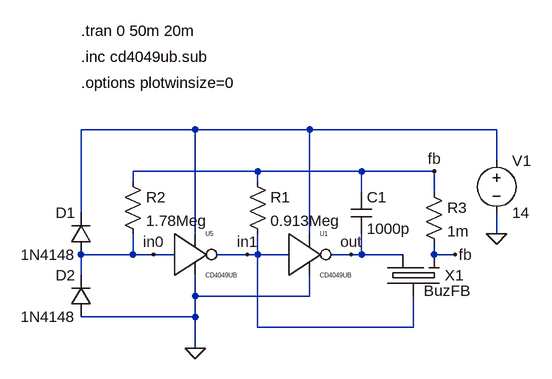
[diagram p0: schematic oscillator test_inverter.asc]
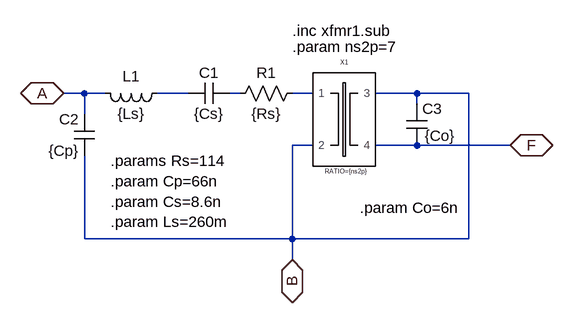
[diagram p1: sub-circuit buzfb.asc]
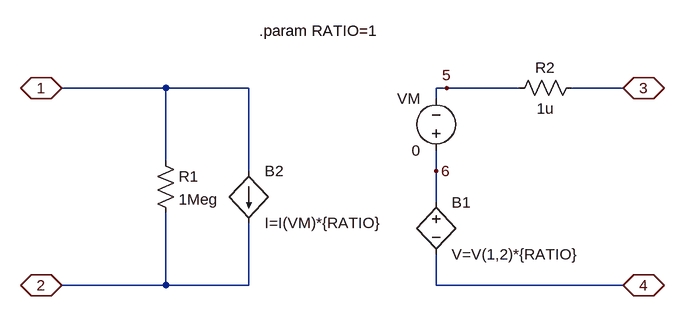
[diagram p2: sub-circuit xmfr1.asc]
oscillator test_inverter.asc, the LTspice schematic file:
Version 4
SHEET 1 1844 964
WIRE 240 -192 64 -192
WIRE 416 -192 240 -192
WIRE 704 -192 416 -192
WIRE 704 -144 704 -192
WIRE 336 -128 144 -128
WIRE 496 -128 336 -128
WIRE 608 -128 496 -128
WIRE 144 -112 144 -128
WIRE 336 -112 336 -128
WIRE 496 -96 496 -128
WIRE 608 -96 608 -128
WIRE 64 -64 64 -192
WIRE 240 -32 240 -192
WIRE 416 -32 416 -192
WIRE 704 -32 704 -64
WIRE 144 0 144 -32
WIRE 144 0 64 0
WIRE 176 0 144 0
WIRE 208 0 176 0
WIRE 320 0 272 0
WIRE 336 0 336 -32
WIRE 336 0 320 0
WIRE 384 0 336 0
WIRE 480 0 448 0
WIRE 496 0 496 -32
WIRE 496 0 480 0
WIRE 560 0 496 0
WIRE 608 0 608 -16
WIRE 640 0 608 0
WIRE 64 32 64 0
WIRE 240 64 240 32
WIRE 416 64 416 32
WIRE 416 64 240 64
WIRE 240 96 240 64
WIRE 240 96 64 96
WIRE 336 112 336 0
WIRE 576 112 576 64
WIRE 576 112 336 112
WIRE 240 144 240 96
FLAG 704 -32 0
FLAG 240 144 0
FLAG 176 0 in0
FLAG 320 0 in1
FLAG 480 0 out
FLAG 608 -128 fb
FLAG 640 0 fb
SYMBOL voltage 704 -160 R0
WINDOW 123 0 0 Left 0
WINDOW 39 0 0 Left 0
SYMATTR InstName V1
SYMATTR Value 14
SYMBOL buffer_inv1 224 0 R0
SYMATTR InstName U5
SYMATTR Value CD4049UB
SYMBOL buffer_inv1 400 0 R0
SYMATTR InstName U1
SYMATTR Value CD4049UB
SYMBOL BuzFB 576 32 R0
SYMATTR InstName X1
SYMBOL res 320 -128 R0
SYMATTR InstName R1
SYMATTR Value 0.913Meg
SYMBOL res 128 -128 R0
SYMATTR InstName R2
SYMATTR Value 1.78Meg
SYMBOL cap 480 -96 R0
SYMATTR InstName C1
SYMATTR Value 1000p
SYMBOL res 592 -112 R0
SYMATTR InstName R3
SYMATTR Value 1m
SYMBOL diode 80 0 R180
WINDOW 0 24 64 Left 2
WINDOW 3 24 0 Left 2
SYMATTR InstName D1
SYMATTR Value 1N4148
SYMBOL diode 80 96 R180
WINDOW 0 24 64 Left 2
WINDOW 3 24 0 Left 2
SYMATTR InstName D2
SYMATTR Value 1N4148
TEXT 64 -264 Left 2 !.options plotwinsize=0
TEXT 64 -304 Left 2 !.inc cd4049ub.sub
TEXT 64 -344 Left 2 !.tran 0 50m 20m

buzfb.asc, the sub-circuit schematic file:
Version 4
SHEET 1 880 680
WIRE -144 -48 -176 -48
WIRE -112 -48 -144 -48
WIRE 16 -48 -32 -48
WIRE 96 -48 80 -48
WIRE 208 -48 176 -48
WIRE 368 -48 304 -48
WIRE 448 -48 368 -48
WIRE 368 -32 368 -48
WIRE -144 -16 -144 -48
WIRE 208 32 176 32
WIRE 368 32 304 32
WIRE 512 32 368 32
WIRE -144 176 -144 48
WIRE 176 176 176 32
WIRE 176 176 -144 176
WIRE 448 176 448 -48
WIRE 448 176 176 176
WIRE 176 208 176 176
FLAG 512 32 F
IOPIN 512 32 BiDir
FLAG -176 -48 A
IOPIN -176 -48 BiDir
FLAG 176 208 B
IOPIN 176 208 BiDir
SYMBOL cap -128 48 R180
WINDOW 0 24 56 Left 2
WINDOW 3 24 8 Left 2
SYMATTR InstName C2
SYMATTR Value {Cp}
SYMBOL cap 352 -32 R0
WINDOW 3 28 49 Left 2
SYMATTR Value {Co}
SYMATTR InstName C3
SYMBOL ind -16 -64 R90
WINDOW 0 5 56 VBottom 2
WINDOW 3 32 56 VTop 2
SYMATTR InstName L1
SYMATTR Value {Ls}
SYMBOL res 192 -64 R90
WINDOW 0 0 56 VBottom 2
WINDOW 3 32 56 VTop 2
SYMATTR InstName R1
SYMATTR Value {Rs}
SYMBOL cap 80 -64 R90
WINDOW 0 0 32 VBottom 2
WINDOW 3 32 32 VTop 2
SYMATTR InstName C1
SYMATTR Value {Cs}
SYMBOL XMFR1 256 -16 R0
SYMATTR InstName X1
SYMATTR SpiceLine RATIO={ns2p}
TEXT -104 56 Left 2 !.params Rs=114\n.param Cp=66n\n.param Cs=8.6n\n.param Ls=260m
TEXT 176 -120 Left 2 !.param ns2p=7
TEXT 176 -144 Left 2 !.inc xfmr1.sub
TEXT 280 128 Left 2 !.param Co=6n

xmfr1.asc, the sub-circuit schematic file:
Version 4
SHEET 1 880 680
WIRE 64 -112 -96 -112
WIRE 192 -112 64 -112
WIRE 496 -112 480 -112
WIRE 608 -112 496 -112
WIRE 768 -112 688 -112
WIRE 480 -96 480 -112
WIRE 64 0 64 -112
WIRE 192 16 192 -112
WIRE 480 16 480 -16
WIRE 480 64 480 16
WIRE 64 192 64 80
WIRE 64 192 -96 192
WIRE 192 192 192 96
WIRE 192 192 64 192
WIRE 480 192 480 144
WIRE 768 192 480 192
FLAG -96 -112 1
IOPIN -96 -112 BiDir
FLAG -96 192 2
IOPIN -96 192 BiDir
FLAG 768 -112 3
IOPIN 768 -112 BiDir
FLAG 768 192 4
IOPIN 768 192 BiDir
FLAG 496 -112 5
FLAG 480 16 6
SYMBOL res 48 -16 R0
SYMATTR InstName R1
SYMATTR Value 1Meg
SYMBOL res 704 -128 R90
WINDOW 0 0 56 VBottom 2
WINDOW 3 32 56 VTop 2
SYMATTR InstName R2
SYMATTR Value 1u
SYMBOL voltage 480 0 R180
WINDOW 0 24 96 Left 2
WINDOW 3 24 16 Left 2
WINDOW 123 0 0 Left 0
WINDOW 39 0 0 Left 0
SYMATTR InstName VM
SYMATTR Value 0
SYMBOL bv 480 48 R0
SYMATTR InstName B1
SYMATTR Value V=V(1,2)*{RATIO}
SYMBOL bi 192 16 R0
SYMATTR InstName B2
SYMATTR Value I=I(VM)*{RATIO}
TEXT 208 -200 Left 2 !.param RATIO=1

The netlist it stands for:
* oscillator test_inverter.asc
V1 N001 0 14
XU5 in0 in1 N001 0 CD4049UB  ; pins IN OUT VCC VSS
XU1 in1 out N001 0 CD4049UB  ; pins IN OUT VCC VSS
XX1 out in1 fb buzfb params: BuzFB Rs=114 Cp=66n Co=6n Cs=8.6n Ls=260m ns2p=7
R1 fb in1 0.913Meg
R2 fb in0 1.78Meg
C1 fb out 1000p
R3 fb fb 1m
D1 in0 N001 1N4148
D2 0 in0 1N4148

* block symbol definitions
.subckt buzfb A B F
C2 B A {Cp}
C3 B F {Co}
L1 N001 A {Ls}
R1 N003 N002 {Rs}
C1 N002 N001 {Cs}
XX1 N003 B B F xmfr1 params: RATIO={ns2p}
.params Rs=114
.param Cp=66n
.param Cs=8.6n
.param Ls=260m
.param ns2p=7
.inc xfmr1.sub
.param Co=6n
.ends buzfb

.subckt xmfr1 1 2 3 4
R1 1 2 1Meg
R2 3 5 1u
VM 6 5 0
B1 6 4 V=V(1,2)*{RATIO}
B2 1 2 I=I(VM)*{RATIO}
.param RATIO=1
.ends xmfr1

.model D D
.lib standard.dio
.options plotwinsize=0
.inc cd4049ub.sub
.tran 0 50m 20m
.backanno
.end